# Altium schematic sheet usb.SchDoc
size A4; SheetNumber: 4; SheetTotal: 8
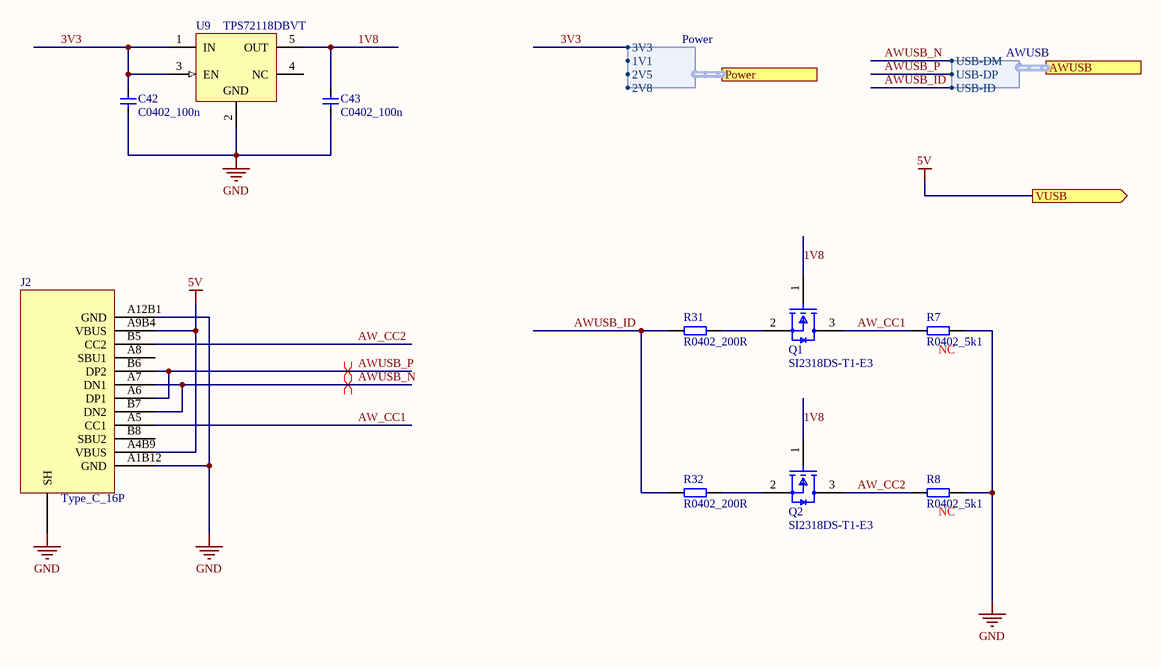
[diagram p0: usb.SchDoc]

## Parts
C42  C0402_100n  [C0402]
C43  C0402_100n  [C0402]
J2  Type_C_16P  [Type_C_16P]
Q1  SI2318DS-T1-E3  [FP-S-03946-MFG]
Q2  SI2318DS-T1-E3  [FP-S-03946-MFG]
R7  R0402_5k1  [R0402]
R8  R0402_5k1  [R0402]
R31  R0402_200R  [R0402]
R32  R0402_200R  [R0402]
U9  TPS72118DBVT  [DBV0005A_L]

## Ports
AWUSB (harness AWUSB), Power (harness Power), VUSB (out)

## Harnesses
AWUSB: USB-DM, USB-DP, USB-ID
Power: 3V3, 1V1, 2V5, 2V8

## Nets
5V: J2.A4B9(VBUS) J2.A9B4(VBUS) ; port VUSB
GND: C42.2 C43.2 J2.0(SH) J2.A1B12(GND) J2.A12B1(GND) R7.2 R8.2 U9.2(GND)
1V8: C43.1 Q1.1(G) Q2.1(G) U9.5(OUT)
3V3: C42.1 U9.1(IN) U9.3(EN) ; port Power.3V3
AW_CC1: J2.A5(CC1) Q1.3(D) R7.1
AW_CC2: J2.B5(CC2) Q2.3(D) R8.1
AWUSB_ID: R31.1 R32.1 ; port AWUSB.USB-ID
AWUSB_N: J2.A7(DN1) J2.B7(DN2) ; port AWUSB.USB-DM
AWUSB_P: J2.A6(DP1) J2.B6(DP2) ; port AWUSB.USB-DP
NetQ1_2: Q1.2(S) R31.2
NetQ2_2: Q2.2(S) R32.2

Not connected (* = marked no-connect by the designer): J2 A8(SBU1) B8(SBU2); U9 4(NC)

## Layout directives
differential pair: AWUSB_N, AWUSB_P

## Notes on the sheet
- (near R7) NC
- (near R8) NC

## Library data of the parts
C42 C43 = CMP-003-0006-1: Manufacturer 1: Kemet; Manufacturer Part Number 1: C0402C104K4RACTU; Dielectric: X7R; Voltage Rating DC: 16V; Value: 100n; Tolerance: 0.1%; Part Number: C0402_100n; Pin Count: 2; Component Type: Standard
Q1 Q2 = CMP-02550-000015-1: MOSFET N-CH 40V 3A SOT23-3; Manufacturer: Vishay; Input Capacitace At Vds: 540pF @ 20V; Turn On Delay Time: 5ns; Standoff Height: 0.01mm; Rthja Max: 120°C/W; Power Dissipation: 0.75W; Number Of Channels: 1; Max Junction Temp: +150°C; Gate Charge At Vgs: 10nC @ 10V; Pulse Drain Current: 16A; Turn Off Delay Time: 20ns; Threshold Vgs Min: 1V; Depletion Mode: False; Max Forward Diode Voltage: 1.2V; Drain To Source Resistance: 0.036Ω; Gate To Source Voltage: 20V; Transconductance: 11S; Threshold Vgs Max: 3V; Typ Forward Diode Voltage: 0.8V; Lead Free: Yes; Temperature Range Low: -55°C; Drain To Source Voltage: 40V; Category: Trans; Number Of N Channels: 1; Temperature Range High: +150°C; RoHS: TRUE; Digikey Description: MOSFET N-CH 40V 3A SOT23-3; Mouser Description: MOSFET 40V 6A; Manufacturer Part Number: SI2318DS-T1-E3; Drain To Source Breakdown Voltage: 40V; ComponentLink2Description: Datasheet; Device Class L1: Discrete Semiconductors; Temperature: -55°C to +150°C; Automotive: No; Package: S-03946; Device Class L3: MOSFETs; Height: 1.12mm; Octopart: https://octopart.com/si2318ds-t1-e3-vishay-40866469; Continuous Drain Current: 3A; Device Class L2: Transistors; ComponentLink2URL: http://www.vishay.com/docs/72322/72322.pdf
R7 R8 = CMP-004-0436-1: Manufacturer 1: Vishay; Manufacturer Part Number 1: CRCW04025K10FKED; Value: 5k1; Tolerance: 1%; Power Rating: 62,5mW; Pin Count: 2; Component Type: Standard; Part Number: R0402_5k1
R31 R32 = CMP-004-0402-1: Manufacturer 1: Vishay; Manufacturer Part Number 1: CRCW0402200RFKED; Tolerance: 1%; Value: 200R; Power Rating: 62,5mW; Part Number: R0402_200R; Pin Count: 2; Component Type: Standard
U9 = CMP-0394-00587-2: Single Output Low Input Voltage Requirement LDO, 150 mA, Fixed 1.8 V Output, 1.8 to 5.5 V Input, with Low IQ, 5-pin SOT-23 (DBV), -40 to 125 degC, Green (RoHS & no Sb/Br); Manufacturer: Texas Instruments; Vout Adj(Min)(V): 1.8; Vdo(Typ)(mV): 150; Vin(Max)(V): 5.5; Accuracy(%): 3; SubFamily: Single Channel LDO; Iout(Max)(A): 0.1; Iq(Typ)(mA): 0.57; PartNumber: TPS72118DBVT; ComponentLink2Description: Datasheet; ComponentLink3Description: Package Specification; Eco-Plan: Green (RoHS & no Sb/Br); ComponentLink2URL: http://www.ti.com/general/docs/lit/getliterature.tsp?genericPartNumber=TPS72118&fileType=pdf; Vout Adj(Max)(V): 1.8; Mounting Technology: Surface Mount; ComponentLink1Description: Manufacturer URL; DatasheetVersion: SLVS352C; ComponentLink3URL: http://www.ti.com/litv/pdf/mpds018i; Fixed Output Options(V): 1.8; PackageReference: DBV0005A; PackageVersion: 4073253-4/K; PackageDescription: 5-Pin Plastic Small Outline, Body 1.60 Ãƒâ€” 2.90 mm, Pitch 0.95 mm; Vin(Min)(V): 1.8; Code_JEDEC: MO-178; ComponentLink1URL: http://www.ti.com/